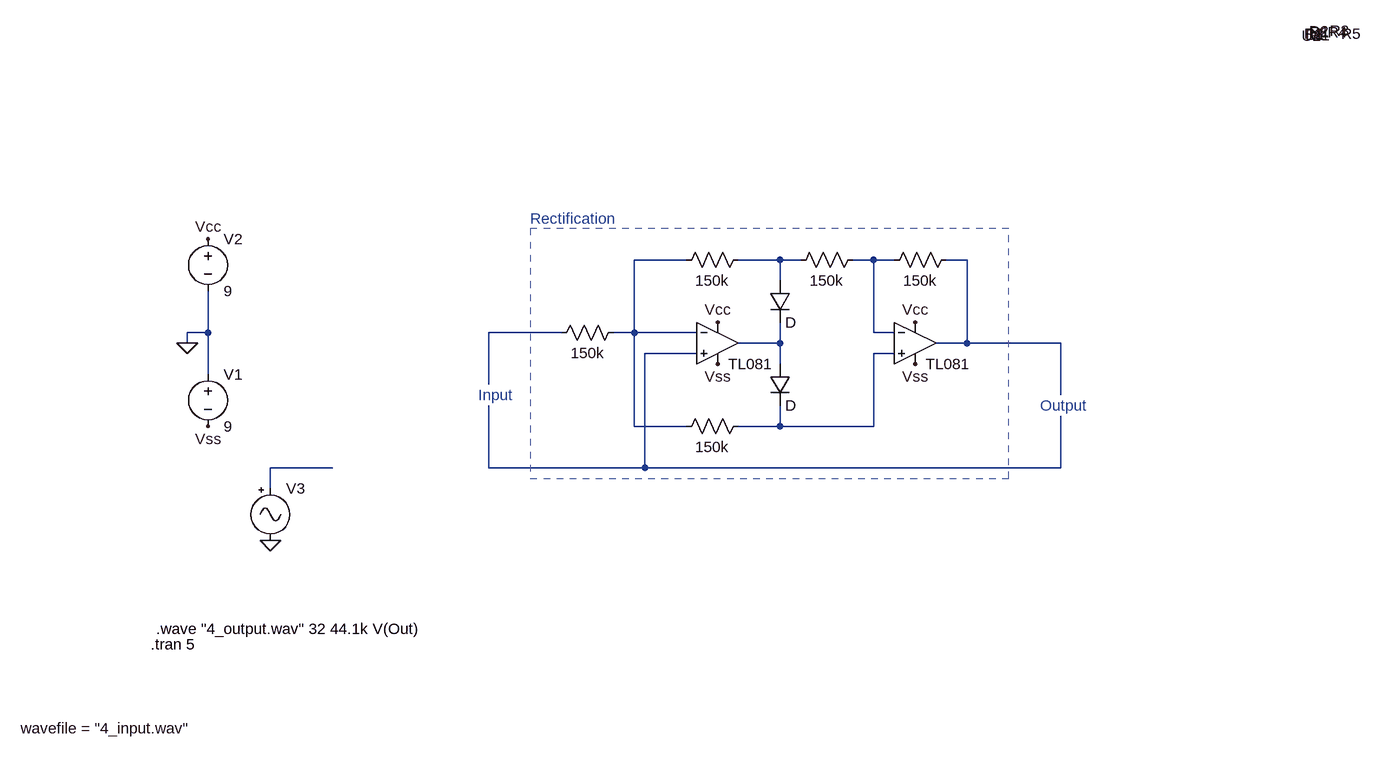
[diagram p0: schematic 4_Rectifier.asc]
4_Rectifier.asc, the LTspice schematic file:
Version 4
SHEET 1 1216 788
WIRE 128 48 48 48
WIRE 272 48 208 48
WIRE 304 48 272 48
WIRE 416 48 384 48
WIRE 448 48 416 48
WIRE 560 48 528 48
WIRE 272 80 272 48
WIRE -608 160 -608 96
WIRE -608 160 -640 160
WIRE -64 160 -176 160
WIRE 48 160 48 48
WIRE 48 160 16 160
WIRE 144 160 48 160
WIRE 416 160 416 48
WIRE 448 160 416 160
WIRE -640 176 -640 160
WIRE 272 176 272 144
WIRE 272 176 208 176
WIRE 560 176 560 48
WIRE 560 176 512 176
WIRE 704 176 560 176
WIRE 144 192 64 192
WIRE 448 192 416 192
WIRE 272 208 272 176
WIRE -608 224 -608 160
WIRE -176 240 -176 160
WIRE 704 256 704 176
WIRE 48 304 48 160
WIRE 128 304 48 304
WIRE 272 304 272 272
WIRE 272 304 208 304
WIRE 416 304 416 192
WIRE 416 304 272 304
WIRE -416 368 -512 368
WIRE -176 368 -176 272
WIRE 64 368 64 192
WIRE 64 368 -176 368
WIRE 704 368 704 288
WIRE 704 368 64 368
WIRE -512 400 -512 368
FLAG -640 176 0
FLAG -608 16 Vcc
FLAG -608 304 Vss
FLAG -512 480 0
FLAG 176 144 Vcc
FLAG 480 144 Vcc
FLAG 176 208 Vss
FLAG 480 208 Vss
SYMBOL voltage -608 208 R0
WINDOW 123 0 0 Left 0
WINDOW 39 0 0 Left 0
SYMATTR InstName V1
SYMATTR Value 9
SYMBOL voltage -608 0 R0
WINDOW 123 0 0 Left 0
WINDOW 39 0 0 Left 0
SYMATTR InstName V2
SYMATTR Value 9
SYMBOL Misc\\signal -512 384 R0
WINDOW 3 -384 385 Left 2
SYMATTR Value wavefile = "4_input.wav"
SYMATTR InstName V3
SYMBOL res 400 32 R90
WINDOW 0 -319 -702 VBottom 2
WINDOW 3 32 56 VTop 2
SYMATTR InstName R1
SYMATTR Value 150k
SYMBOL res 544 32 R90
WINDOW 0 -317 -550 VBottom 2
WINDOW 3 32 56 VTop 2
SYMATTR InstName R2
SYMATTR Value 150k
SYMBOL res 224 32 R90
WINDOW 0 -321 -909 VBottom 2
WINDOW 3 32 56 VTop 2
SYMATTR InstName R3
SYMATTR Value 150k
SYMBOL res 224 288 R90
WINDOW 0 -575 -906 VBottom 2
WINDOW 3 32 56 VTop 2
SYMATTR InstName R4
SYMATTR Value 150k
SYMBOL res 32 144 R90
WINDOW 0 -429 -1119 VBottom 2
WINDOW 3 32 56 VTop 2
SYMATTR InstName R5
SYMATTR Value 150k
SYMBOL diode 256 80 R0
WINDOW 0 825 -379 Left 2
SYMATTR InstName D1
SYMBOL diode 256 208 R0
WINDOW 0 830 -512 Left 2
SYMATTR InstName D2
SYMBOL AutoGenerated\\TL081 176 112 R0
WINDOW 0 912 -410 Left 2
SYMATTR InstName U1
SYMBOL AutoGenerated\\TL081 480 112 R0
WINDOW 0 595 -409 Left 2
SYMATTR InstName U2
TEXT -696 640 Left 2 !.tran 5
TEXT -688 616 Left 2 !.wave "4_output.wav" 32 44.1k V(Out)
TEXT -112 -16 Left 2 ;Rectification
TEXT -192 256 Left 2 ;Input
TEXT 672 272 Left 2 ;Output
RECTANGLE Normal -112 384 624 0 2

The netlist it stands for:
* 4_Rectifier.asc
V1 0 Vss 9
V2 Vcc 0 9
V3 N009 0 wavefile = "4_input.wav"
R1 N003 N002 150k
R2 N004 N003 150k
R3 N002 N001 150k
R4 N008 N001 150k
R5 N001 N005 150k
D1 N002 N006 D
D2 N006 N008 D
* U1: TL081 (symbol AutoGenerated\TL081 not available, pins judged from their places): In+=N007 In-=N001 V+=Vcc V-=Vss OUT=N006
* U2: TL081 (symbol AutoGenerated\TL081 not available, pins judged from their places): In+=N008 In-=N003 V+=Vcc V-=Vss OUT=N004
.model D D
.lib standard.dio
.tran 5
.wave "4_output.wav" 32 44.1k V(Out)
* Rectification
* Input
* Output
.backanno
.end